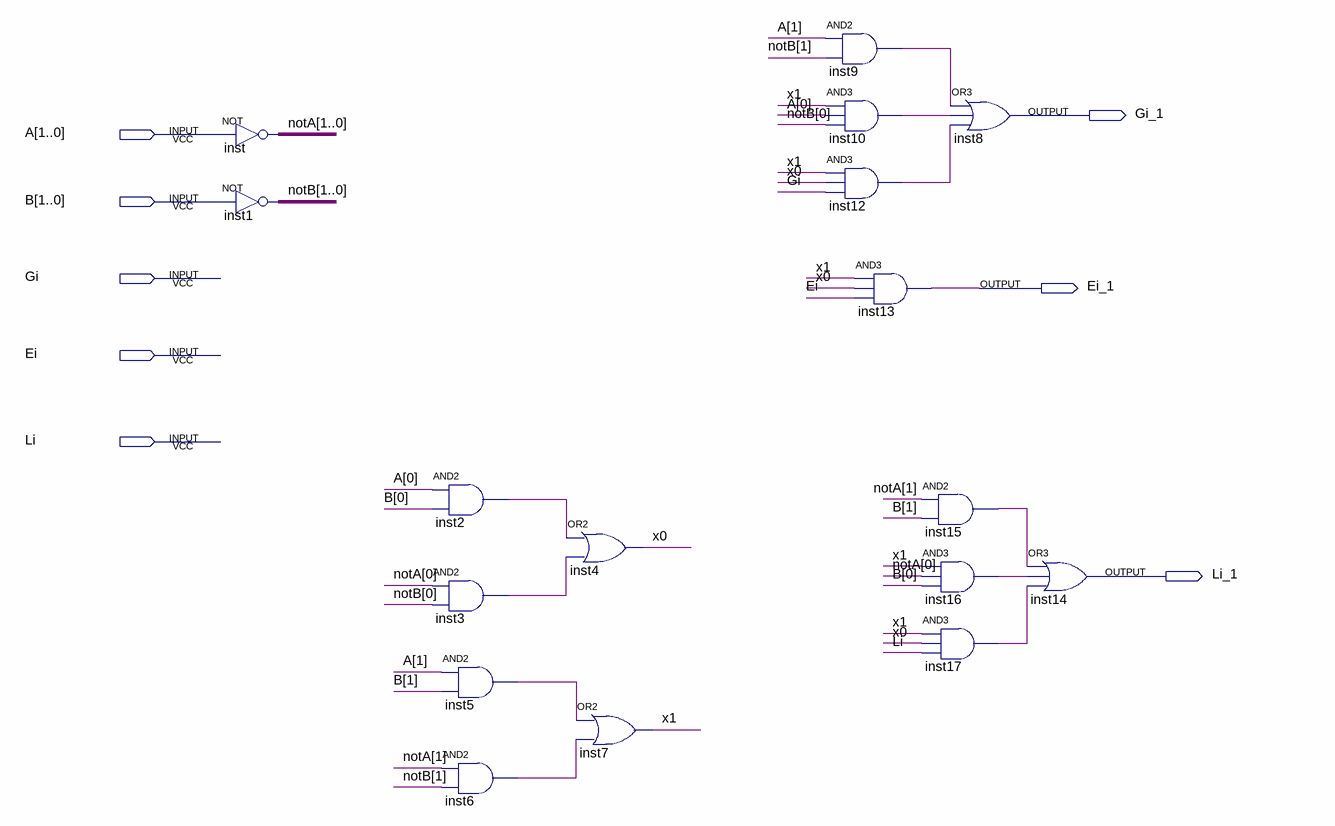
[diagram p0: schematic sheet]
// Quartus schematic cmp2.bdf as structural Verilog: 17 symbols, 8 pins
module cmp2 (
  input  [1:0] A,
  input  [1:0] B,
  input  Gi,
  input  Ei,
  input  Li,
  output Gi_1,
  output Ei_1,
  output Li_1
);

  wire inst2_out, inst3_out, inst5_out, inst6_out, inst9_out, inst10_out, inst12_out, inst15_out, inst16_out,
       inst17_out, x0, x1;
  wire [1:0] notA, notB;

  assign notA = ~A;  // NOT inst, 2 bits wide
  assign notB = ~B;  // NOT inst1, 2 bits wide
  and inst2 (inst2_out, A[0], B[0]);
  and inst3 (inst3_out, notA[0], notB[0]);
  and inst5 (inst5_out, A[1], B[1]);
  and inst6 (inst6_out, notA[1], notB[1]);
  or inst4 (x0, inst2_out, inst3_out);
  or inst7 (x1, inst5_out, inst6_out);
  and inst9 (inst9_out, A[1], notB[1]);
  and inst10 (inst10_out, x1, A[0], notB[0]);
  and inst12 (inst12_out, x1, x0, Gi);
  and inst13 (Ei_1, x1, x0, Ei);
  or inst8 (Gi_1, inst9_out, inst10_out, inst12_out);
  and inst15 (inst15_out, notA[1], B[1]);
  and inst16 (inst16_out, x1, notA[0], B[0]);
  and inst17 (inst17_out, x1, x0, Li);
  or inst14 (Li_1, inst15_out, inst16_out, inst17_out);
endmodule
